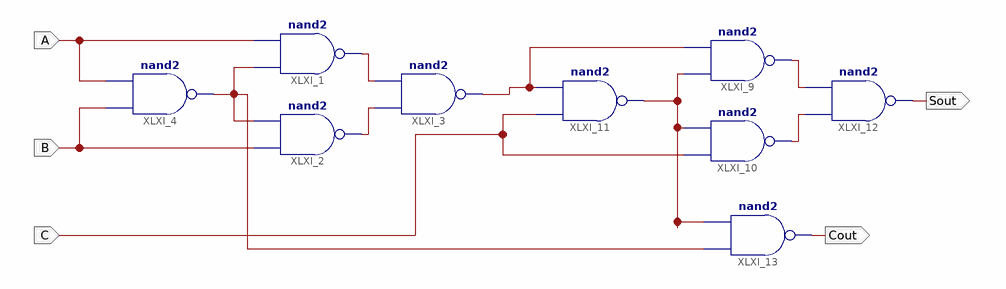
[diagram p0: schematic sheet 1]
// Xilinx ISE schematic FullAdder_NAND.sch (spartan3e) as structural Verilog: 9 symbols, 5 ports
module FullAdder_NAND (
  input  B,
  input  A,
  input  C,
  output Cout,
  output Sout
);

  wire XLXN_16, XLXN_18, XLXN_26, XLXN_27, XLXN_30, XLXN_31, XLXN_34;

  nand XLXI_3 (XLXN_31, XLXN_18, XLXN_16);
  nand XLXI_4 (XLXN_34, B, A);
  nand XLXI_1 (XLXN_16, XLXN_34, A);
  nand XLXI_2 (XLXN_18, B, XLXN_34);
  nand XLXI_9 (XLXN_26, XLXN_30, XLXN_31);
  nand XLXI_10 (XLXN_27, C, XLXN_30);
  nand XLXI_11 (XLXN_30, C, XLXN_31);
  nand XLXI_12 (Sout, XLXN_27, XLXN_26);
  nand XLXI_13 (Cout, XLXN_34, XLXN_30);
endmodule
